# Altium schematic sheet power.SchDoc: Power
size A4; CheckedBy: None; DrawnBy: David, Andrea; DocumentNumber: 3; Revision: v1.0; SheetNumber: 3; SheetTotal: 7; SPICEModelCacheWKKYIPZN: <root> / <DocumentId>WKKYIPZN</DocumentId> / <CacheFrame Number="0"> / <Model Name="cap" Kind="MDL"> / <Text>*Default semiconductor capacitor / .MODEL CAP C()</Text> / </Model> / </CacheFrame> / </root>; VersionRevision: v1.0; TotalSheet: 7; Company: ETSIT; Project: Hefesto
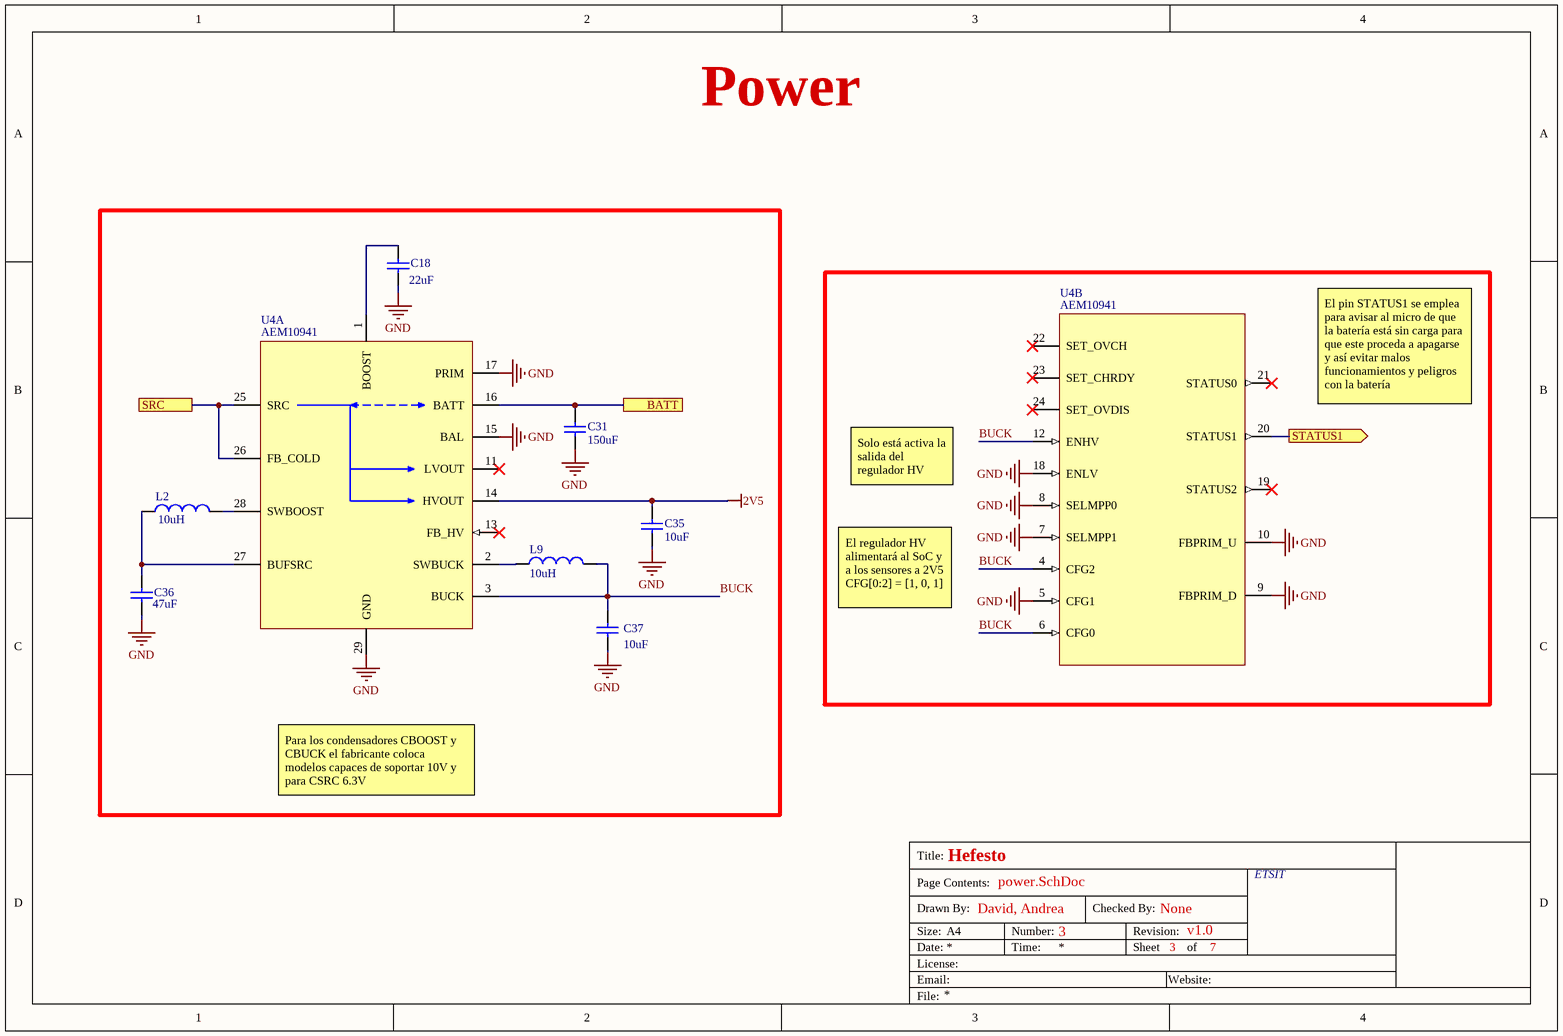
[diagram p0: power.SchDoc]

## Parts
C18  value 22uF  [1608[0603]]  (hidden comment: Cap Semi)
C31  value 150uF  [1608[0603]]
C35  value 10uF  [1608[0603]]
C36  value 47uF  [1608[0603]]  (hidden comment: Cap Semi)
C37  value 10uF  [1608[0603]]
L2  LBOOST: 10uH  [0603]
L9  LBOOST: 10uH  [0603]
U4  AEM10941  [AEM10941]  (parts A,B of 2)

## Ports
BATT (see main[3A]), SRC (see main[3A]), STATUS1 (out, see main[3B])

## Nets
2V5: C35.2 U4.14(HVOUT)
GND: C18.1 C31.1 C35.1 C36.1 C37.1 U4.5(CFG1) U4.7(SELMPP1) U4.8(SELMPP0) U4.9(FBPRIM_D) U4.10(FBPRIM_U) U4.15(BAL) U4.17(PRIM) U4.18(ENLV) U4.29(GND)
BATT: C31.2 U4.16(BATT) ; port BATT
BUCK: C37.2 L9.1 U4.3(BUCK) U4.4(CFG2) U4.6(CFG0) U4.12(ENHV)
SRC: U4.25(SRC) U4.26(FB_COLD) ; port SRC
STATUS1: U4.20(STATUS1) ; port STATUS1
NetC18_2: C18.2 U4.1(BOOST)
NetC36_2: C36.2 L2.1 U4.27(BUFSRC)
NetL2_2: L2.2 U4.28(SWBOOST)
NetL9_2: L9.2 U4.2(SWBUCK)

Not connected (* = marked no-connect by the designer): U4 11(LVOUT)* 13(FB_HV)* 19(STATUS2)* 21(STATUS0)* 22(SET_OVCH)* 23(SET_CHRDY)* 24(SET_OVDIS)*

## Notes on the sheet
- El pin STATUS1 se emplea para avisar al micro de que la batería está sin carga para que este proceda a apagarse y así evitar malos funcionamientos y peligros con la batería
- Solo está activa la salida del regulador HV
- El regulador HV alimentará al SoC y a los sensores a 2V5              CFG[0:2] = [1, 0, 1]
- Para los condensadores CBOOST y CBUCK el fabricante coloca modelos capaces de soportar 10V y para CSRC 6.3V
- Title:
- Drawn By:
- Page Contents:
- Checked By:
- Size:
- Date:
- File:
- License:
- Email:
- A4
- Number:
- Time:
- Revision:
- Sheet
- Website:
- of

## Library data of the parts
C18 C31 C35-C37 = Cap Semi: Capacitor (Semiconductor SIM Model); Published: 8-Jun-2000; LatestRevisionDate: 29-May-2009; LatestRevisionNote: IPC-7351 Footprint Added.; PackageReference: C1206; Publisher: Altium Limited; PackageDescription: Chip Capacitor
L2 L9 = Inductor: Code_IEC: 1005; Published: 8-Jun-2000; LatestRevisionDate: 29-May-2009; LatestRevisionNote: IPC-7351 Footprint Added.; PackageReference: 0402-A; Publisher: Altium Limited; PackageDescription: Chip Inductor; Code_JEITA: 0402
U4 = AEM10941: AEM10941 - Symbol QFN28